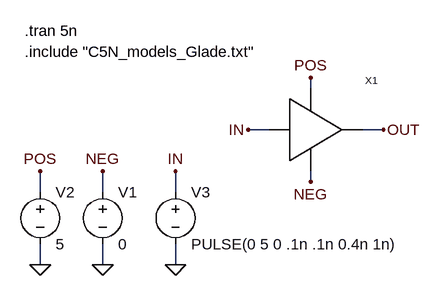
[diagram p0: schematic buffer_top.asc]
buffer_top.asc, the LTspice schematic file:
Version 4
SHEET 1 880 680
WIRE 192 112 192 96
WIRE 128 176 96 176
WIRE 304 176 272 176
WIRE 192 256 192 240
WIRE -224 272 -224 240
WIRE -128 272 -128 240
WIRE -16 272 -16 240
WIRE -224 384 -224 352
WIRE -128 384 -128 352
WIRE -16 384 -16 352
FLAG 192 96 POS
FLAG 192 256 NEG
FLAG 96 176 IN
FLAG 304 176 OUT
FLAG -128 384 0
FLAG -224 384 0
FLAG -16 384 0
FLAG -128 240 NEG
FLAG -224 240 POS
FLAG -16 240 IN
SYMBOL buffer 192 176 R0
SYMATTR InstName X1
SYMBOL voltage -128 256 R0
SYMATTR InstName V1
SYMATTR Value 0
SYMBOL voltage -224 256 R0
WINDOW 123 0 0 Left 0
WINDOW 39 0 0 Left 0
SYMATTR InstName V2
SYMATTR Value 5
SYMBOL voltage -16 256 R0
WINDOW 123 0 0 Left 0
WINDOW 39 0 0 Left 0
SYMATTR InstName V3
SYMATTR Value PULSE(0 5 0 .1n .1n 0.4n 1n)
TEXT -248 24 Left 2 !.tran 5n
TEXT -248 56 Left 2 !.include "C5N_models_Glade.txt"

The netlist it stands for:
* buffer_top.asc
XX1 IN OUT POS NEG buffer  ; pins IN OUT POS NEG
V1 NEG 0 0
V2 POS 0 5
V3 IN 0 PULSE(0 5 0 .1n .1n 0.4n 1n)
.tran 5n
.include "C5N_models_Glade.txt"
.backanno
.end

* Results of the author's LTspice run, read from the files saved beside the schematic
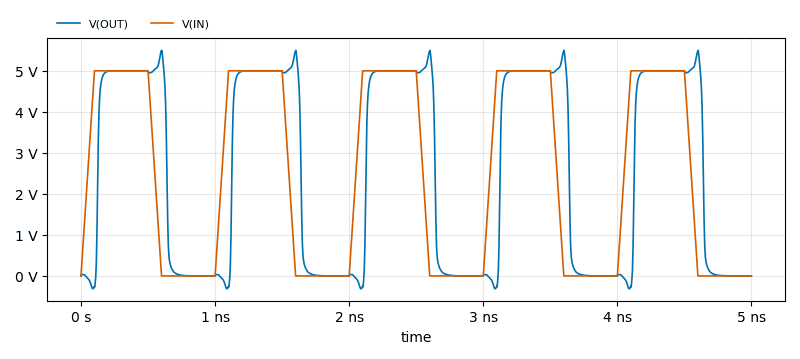
[diagram p1: Transient Analysis of buffer_top.asc, plotted from the saved traces]
* Transient Analysis, 1 run:
*   V(OUT): min -314.2 mV, max 5.498 V, average 2.577 V, rms 3.56 V, last 10.74 µV
*   V(IN): min 0 V, max 5 V, average 2.5 V, rms 3.416 V, last 0 V